# EAGLE design esp-oled-thing (EAGLE 6.2)
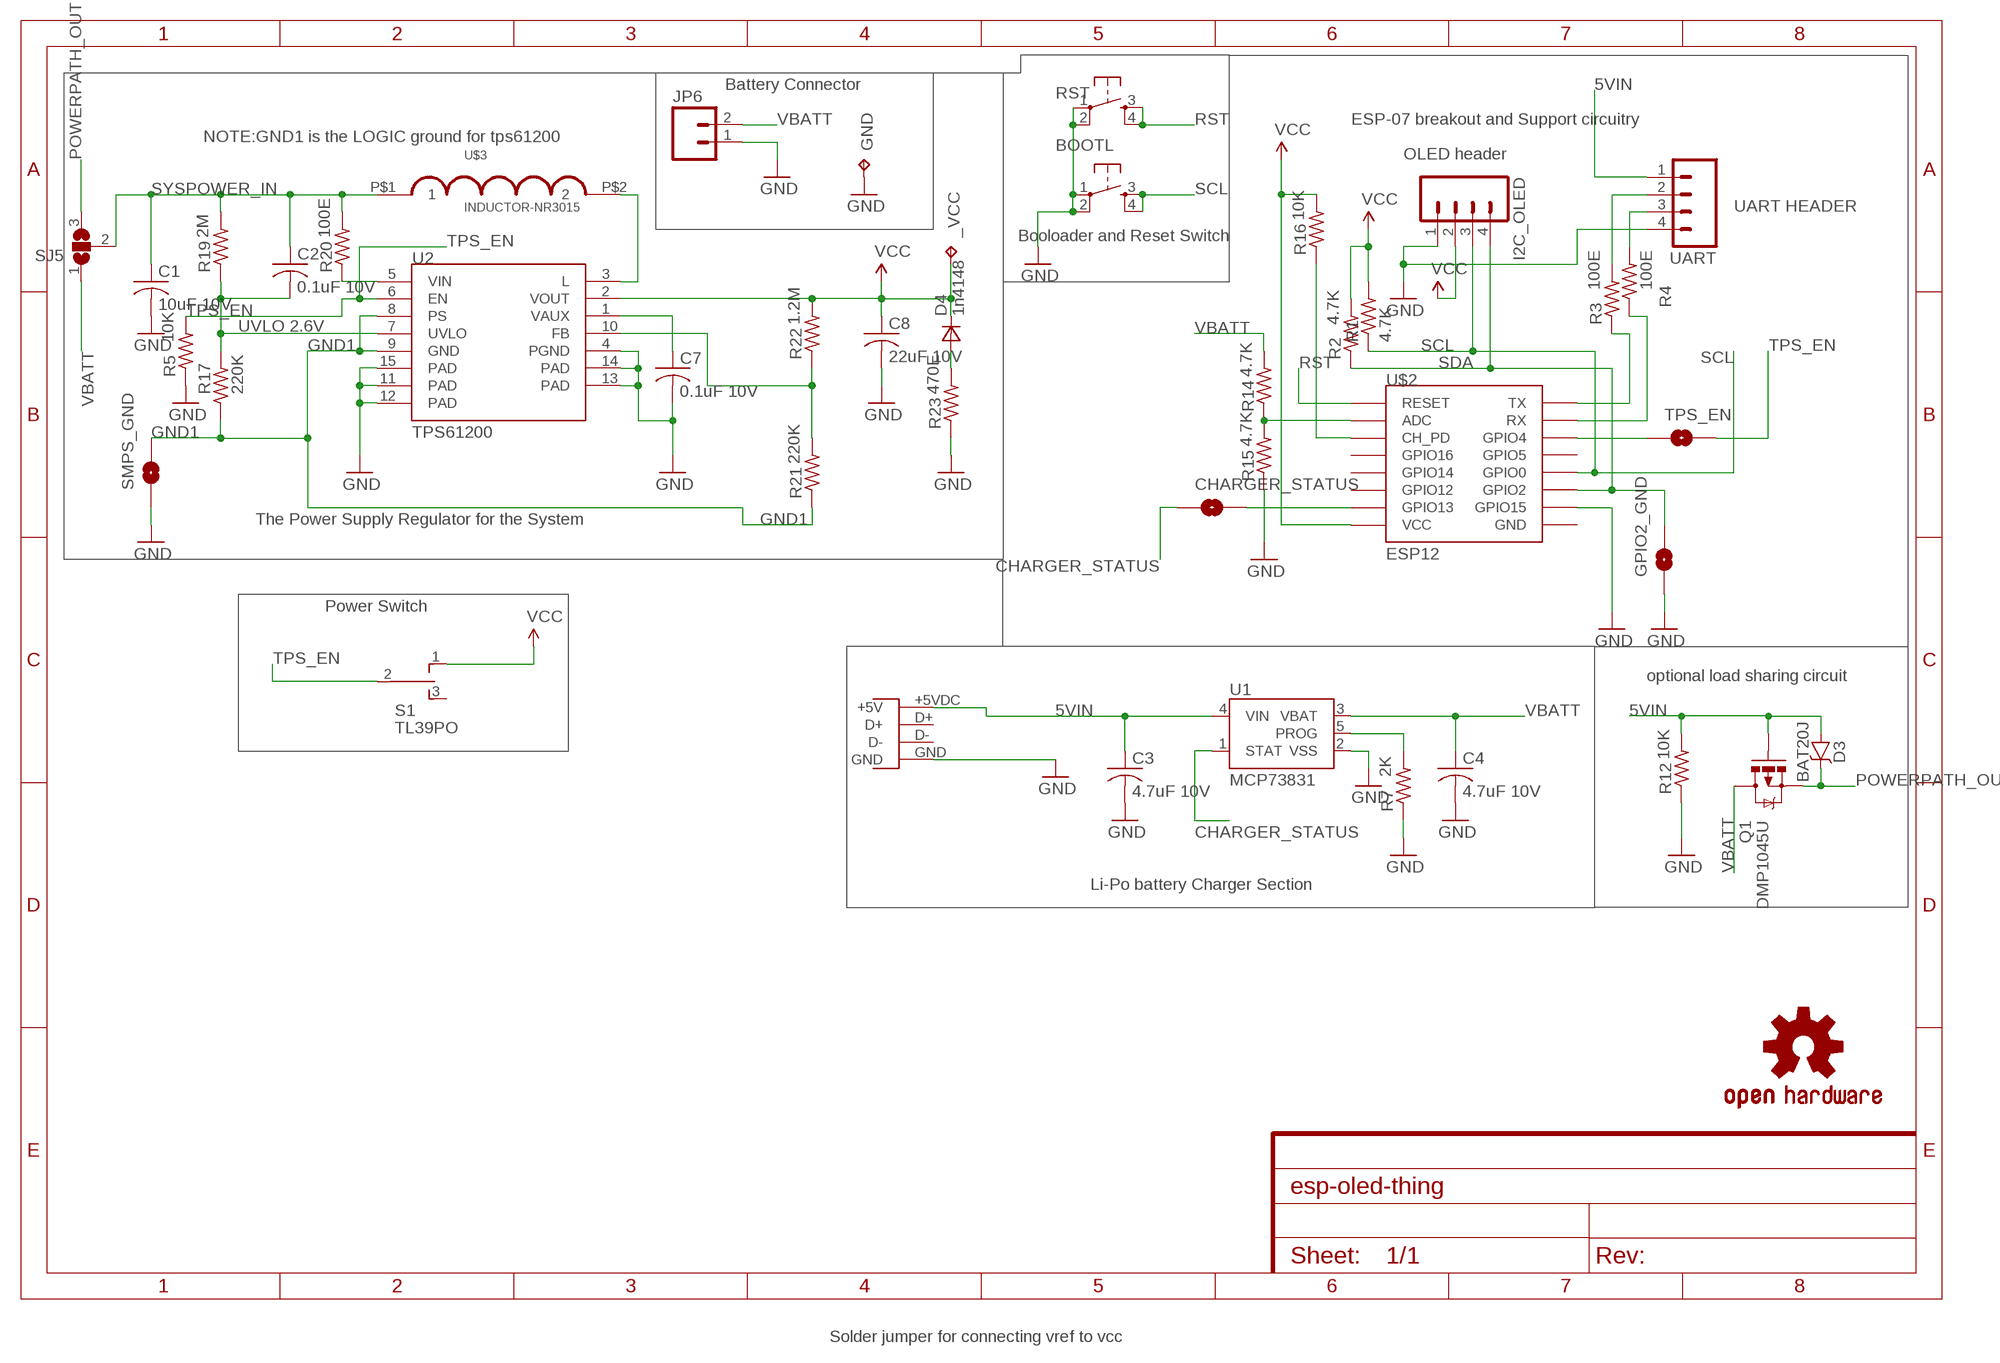
[diagram p0: schematic, sheet 1]

## Parts
_VCC  TPTP10R  [TP10R]
BOOTL  TAC_SWITCHSMD  [TACTILE_SWITCH_SMD]
C1  10uF 10V  C-USC0805  [C0805]
C2  0.1uF 10V  C-USC0805  [C0805]
C3  4.7uF 10V  C-USC0805  [C0805]
C4  4.7uF 10V  C-USC0805  [C0805]
C7  0.1uF 10V  C-USC0805  [C0805]
C8  22uF 10V  C-USC0805  [C0805]
CHARGER_STATUS  SOLDERJUMPERNO  [SJ_2S-NO]
D3  BAT20J  DIODE-SCHOTTKY-BAT20J  [SOD-323]
D4  1n4148  DSOD323  [SOD323]
GND  TPTP10R  [TP10R]
GPIO2_GND  SOLDERJUMPERNO  [SJ_2S-NO]
I2C_OLED  M04PTH  [1X04]
JP6  M02JST-PTH-2  [JST-2-PTH]
Q1  DMP1045U  MOSFET-PCHANNELDMG2307L  [SOT23-3]
R1  4.7K  R-US_M0805  [M0805]
R2  4.7K  R-US_M0805  [M0805]
R3  100E  R-US_M0805  [M0805]
R4  100E  R-US_M0805  [M0805]
R5  10K  R-US_M0805  [M0805]
R7  2K  R-US_M0805  [M0805]
R12  10K  R-US_M0805  [M0805]
R14  4.7K  R-US_M0805  [M0805]
R15  4.7K  R-US_M0805  [M0805]
R16  10K  R-US_M0805  [M0805]
R17  220K  R-US_M0805  [M0805]
R19  2M  R-US_M0805  [M0805]
R20  100E  R-US_M0805  [M0805]
R21  220K  R-US_M0805  [M0805]
R22  1.2M  R-US_M0805  [M0805]
R23  470E  R-US_M0805  [M0805]
RST  TAC_SWITCHSMD  [TACTILE_SWITCH_SMD]
S1  TL39PO  [TL3XPO]
SJ5  SJ2W  [SJ_2]
SMPS_GND  SOLDERJUMPERNO  [SJ_2S-NO]
TPS_EN  SOLDERJUMPERNO  [SJ_2S-NO]
U1  MCP73831  [SOT23-5]
U2  TPS61200  [QFN-10_PAD]
U$1  OSHW-LOGOS  [OSHW-LOGO-S]
U$2  ESP12  [ESP12]
U$3  INDUCTOR-NR3015  [INDUCTOR-NR3015]
U$4  MICROUSB-MIDMOUNT  [MICROUSB-MIDMOUNT-MOLEX]
UART  M04LONGPADS  [1X04_LONGPADS]

## Nets
5VIN: C3.1 D3.A Q1.1(G) R12.2 U1.4(VIN) U$4.+5VDC(+5V) UART.1
CHARGER_STATUS: CHARGER_STATUS.1 U1.1(STAT)
FB: R21.2 R22.1 U2.10(FB)
GND: BOOTL.1 BOOTL.2 C1.2 C3.2 C4.2 C7.2 C8.2 GND.TP GPIO2_GND.1 I2C_OLED.1 JP6.1 R5.1 R7.1 R12.1 R15.1 R23.1 RST.1 RST.2 SMPS_GND.1 U1.2(VSS) U2.4(PGND) U2.11(PAD) U2.12(PAD) U2.13(PAD) U2.14(PAD) U2.15(PAD) U$2.GPIO15 U$4.GND UART.4
GND1: R17.1 R21.1 SMPS_GND.2 U2.8(PS) U2.9(GND)
N$1: CHARGER_STATUS.2 U$2.GPIO13
N$2: R14.1 R15.2 U$2.ADC
N$3: R16.1 U$2.CH_PD
N$4: R3.2 UART.2
N$5: TPS_EN.1 U$2.GPIO4
N$8: R4.2 UART.3
N$13: R7.2 U1.5(PROG)
N$14: U2.3(L) U$3.P$2
N$18: C7.1 U2.1(VAUX)
N$19: R3.1 U$2.TX
N$20: R4.1 U$2.RX
N$21: D4.2(A) R23.2
POWERPATH_OUT: D3.C Q1.2(S) SJ5.3
RST: RST.3 RST.4 U$2.RESET
SCL: BOOTL.3 BOOTL.4 I2C_OLED.3 R1.1 U$2.GPIO0
SDA: GPIO2_GND.2 I2C_OLED.4 R2.1 U$2.GPIO2
SYSPOWER_IN: C1.1 C2.1 R19.2 R20.2 SJ5.2 U$3.P$1
TPS_EN: R5.2 S1.2(P) TPS_EN.2 U2.6(EN)
UVLO: C2.2 R17.2 R19.1 U2.7(UVLO)
VBATT: C4.1 JP6.2 Q1.3(D) R14.2 SJ5.1 U1.3(VBAT)
VCC: _VCC.TP C8.1 D4.1(C) I2C_OLED.2 R1.2 R2.2 R16.2 R22.2 S1.1(O) U2.2(VOUT) U$2.VCC
VIN: R20.1 U2.5(VIN)
Unconnected: S1.3(S) U$2.GND U$2.GPIO5 U$2.GPIO12 U$2.GPIO14 U$2.GPIO16 U$4.D+ U$4.D-

## Notes on the sheet
- Battery Connector
- ESP-07 breakout and Support circuitry
- NOTE:GND1 is the LOGIC ground for tps61200
- OLED header
- UART HEADER
- Booloader and Reset Switch
- UVLO 2.6V
- The Power Supply Regulator for the System
- Power Switch
- optional load sharing circuit
- Li-Po battery Charger Section
- Solder jumper for connecting vref to vcc

## Library data of the parts
_VCC GND = testpad:TP: Test pad
BOOTL RST = SparkFun:TAC_SWITCH: Momentary Switch Button commonly used for reset or general input. Spark Fun Electronics SKU : COM-00097
C1-C4 C7 C8 = rcl:C-US: CAPACITOR, American symbol
CHARGER_STATUS GPIO2_GND SMPS_GND TPS_EN = SparkFun:SOLDERJUMPER: Solder Jumper Standard SMD solder jumper. Used to automate production. Two varients : Normally Open and Normally Closed are the same, but have different paste layers. NC will have a large amount of paste and should jumper during reflow.
D3 = SparkFun-DiscreteSemi:DIODE-SCHOTTKY: Schottky diodes in SFE's production catalog BAT20J 1A 23V 0.62Vf RB751 120mA 40V 0.37Vf PMEG4005EJ 0.5A 40V 0.42Vf MBRA140 1A 40V 0.5Vf B340A 3A 40V SMA; PROD_ID: DIO-11623
D4 = zetex:D: DIODE; MPN: CDSOD323-T05C; OC_FARNELL: 1824860; OC_NEWARK: 79R6078
I2C_OLED UART = SparkFun:M04: Header 4 Standard 4-pin 0.1" header. Use with straight break away headers (SKU : PRT-00116), right angle break away headers (PRT-00553), swiss pins (PRT-00743), machine pins (PRT-00117), and female headers (PRT-00115). Molex polarized connector foot print use with SKU : PRT-08231 with associated crimp pins and housings. 1MM SMD Version SKU: PRT-10208
JP6 = SparkFun:M02: Header 2 Standard 2-pin 0.1" header. Use with straight break away headers (SKU : PRT-00116), right angle break away headers (PRT-00553), swiss pins (PRT-00743), machine pins (PRT-00117), and female headers (PRT-00115). Molex polarized connector foot print use with SKU : PRT-08233 with associated crimp pins and housings.
Q1 = SparkFun-DiscreteSemi:MOSFET-PCHANNEL: Generic PMOSFET IRLML2244 - TRANS-11153 (SOT-23 -20V -4.3A) (1.Gate 2.Source 3.Drain) FQP27P06 - COM-10349 <http://www.sparkfun.com/products/10349> (TO-220 -60V -27A) (1.Gate 2.Source 3.Drain); PROD_ID: TRANS-11308; VALUE: 2.5A/30V
R1-R5 R7 R12 R14-R17 R19-R23 = adafruit:R-US_: RESISTOR, American symbol
S1 = switch:TL39PO: TINY SWITCH ON OFF ON Source: http://www2.produktinfo.conrad.com/datenblaetter/700000-724999/705152-da-01-de-Subminiaturschalter_TL_36YO.pdf
SJ5 = jumper:SJ2W: SMD solder JUMPER
U1 = SparkFun:MCP73831: Microchip's MCP73831 Miniature single cell, fully integrated Li-Ion, Li-polymer charge management controller http://ww1.microchip.com/downloads/en/DeviceDoc/21984a.pdf
U2 = SparkFun:TPS61200: DC to DC Booster
U$1 = SparkFun:OSHW-LOGO: Open Source Hardware Logo This logo indicates the piece of hardware it is found on incorporates a OSHW license and/or adheres to the definition of open source hardware found here: http://freedomdefined.org/OSHW
U$2 = esp8266modules:ESP12: ESP8266 Wifi module 12
U$3 = farasbee:INDUCTOR-NR3015
U$4 = farasbee:MICROUSB-MIDMOUNT

## Board
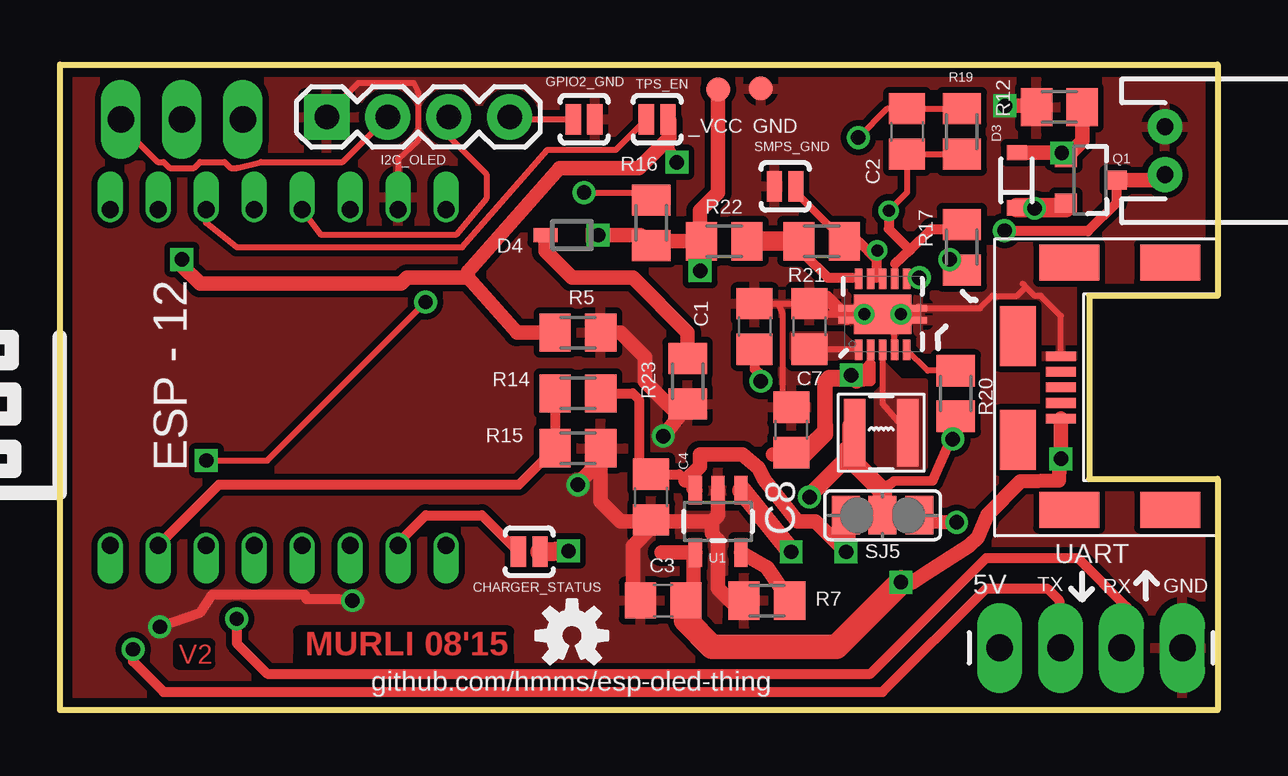
[diagram p1: board, top side]
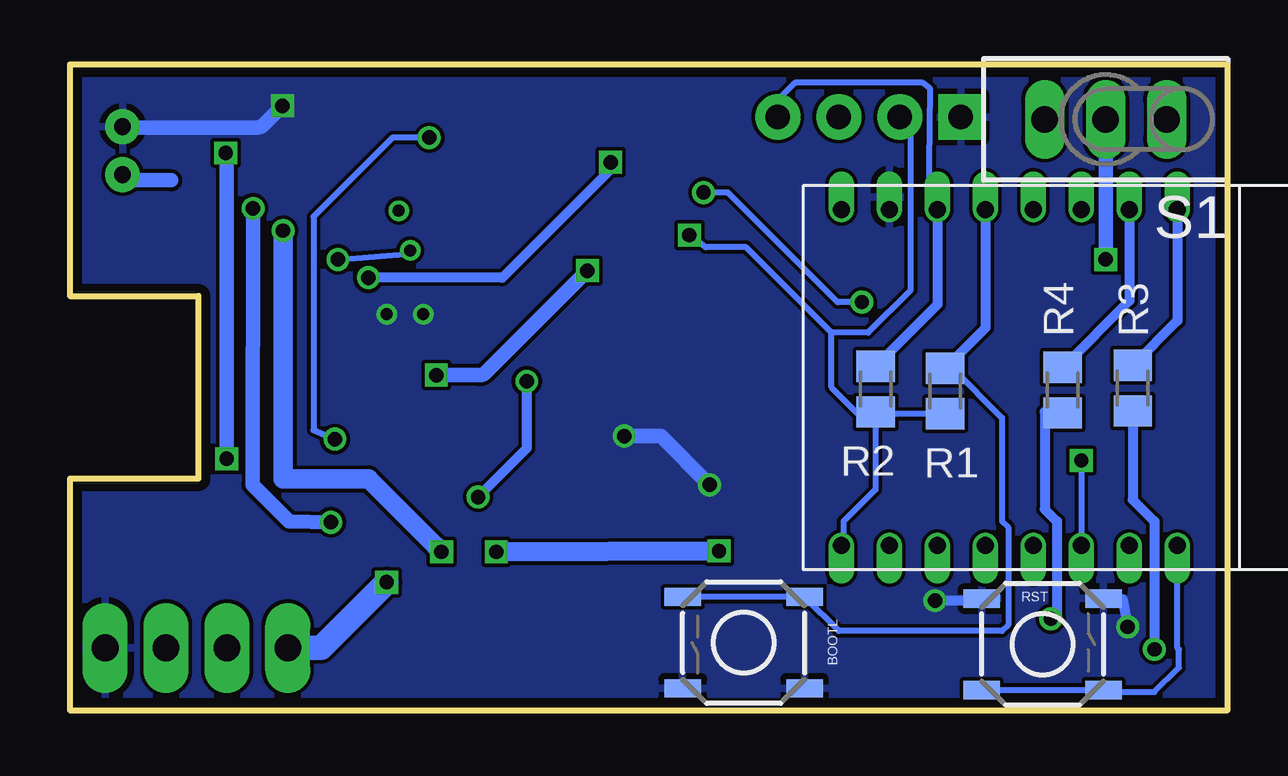
[diagram p2: board, bottom side, seen from below]

Size 48.26 x 27 mm. Coordinates in mm from the lower left corner, seen from the top.
Outline: 0,0 48.24,0
Outline: 48.24,27 0,27 0,26.92
Outline: 0,0 48.26,0 48.26,9.65 42.9,9.65 42.9,17.27 48.26,17.27 48.26,26.92 0,26.92
Outline: 0,0 0,26.92
Copper layers (1*16): Top 0.0356mm / dielectric 1.5011mm / Bottom 0.0356mm
Design rules: minimum track width 6mil, minimum drill 13mil, track to track 6mil, track to pad 6mil, pad to pad 6mil, via to via 6mil, smd to smd 6mil, copper to edge 15mil, drill to drill 6mil, minimum pad ring 7mil, minimum via ring 7mil, stop-mask expansion 3mil, vias tented up to drill 0mil, thermal gap 10mil

### Footprints (pad centres in the part's own frame; a part is rotated, then mirrored left to right if it is on the bottom)
TP10R = smd 1 x 1: TP 0,0
TACTILE_SWITCH_SMD = smd 1.524 x 0.762: 1 -2.54,1.905; 2 2.54,1.905; 3 -2.54,-1.905; 4 2.54,-1.905
C0805 = smd 1.3 x 1.5: 1 -0.95,0; 2 0.95,0
SJ_2S-NO = smd 0.635 x 1.27: 1 -0.45,0; 2 0.45,0
SOD-323 = smd 0.63 x 0.83: A 1.15,0; C -1.15,0
SOD323 = smd 1 x 0.6: 1 -1.1,0; 2 1.1,0
1X04 = drill 1.016 pad 1.88 square: 1 0,0 | drill 1.016 pad 1.88: 2 2.54,0; 3 5.08,0; 4 7.62,0
JST-2-PTH = drill 0.7 pad 1.448: 1 -1,0; 2 1,0
SOT23-3 = smd 0.8 x 0.9: 1 -0.95,-1; 2 0.95,-1; 3 0,1.1
M0805 = smd 1.3 x 1.6: 1 -0.95,0; 2 0.95,0
TL3XPO = drill 1.1 pad 1.422 long: 1 -2.54,0; 2 0,0; 3 2.54,0
SJ_2 = smd 1.168 x 1.6: 1 -1.524,0; 2 0,0; 3 1.524,0
SOT23-5 = smd 0.55 x 1.2: 1 -0.95,-1.3; 2 0,-1.3; 3 0.95,-1.3; 4 0.95,1.3; 5 -0.95,1.3
QFN-10_PAD = smd 0.297 x 0.85: 1 -1,-1.475; 2 -0.5,-1.475; 3 0,-1.475; 4 0.5,-1.475; 5 1,-1.475; 6 1,1.475; 7 0.5,1.475; 8 0,1.475; 9 -0.5,1.475; 10 -1,1.475 | smd 0.7 x 0.28: 11 -1.5,0.25; 12 -1.5,-0.25; 13 1.5,0.25; 14 1.5,-0.25 | smd 2.4 x 1.65: 15 0,0
ESP12 = drill 0.7 offset: ADC -7.1,3.8; CH_PD -7.1,1.8; GND 6.9,-8.2; GPIO0 6.9,-2.2; GPIO2 6.9,-4.2; GPIO4 6.9,1.8; GPIO5 6.9,-0.2; GPIO12 -7.1,-4.2; GPIO13 -7.1,-6.2; GPIO14 -7.1,-2.2; GPIO15 6.9,-6.2; GPIO16 -7.1,-0.2; RESET -7.1,5.8; RX 6.9,3.8; TX 6.9,5.8; VCC -7.1,-8.2
INDUCTOR-NR3015 = smd 0.9 x 2.8: P$1 -1.1,0; P$2 1.1,0
MICROUSB-MIDMOUNT-MOLEX = smd 0.4 x 1.25: +5VDC -1.3,0.95; D+ 0,0.95; D- -0.65,0.95; GND 1.3,0.95; ID 0.65,0.95 | smd 1.5 x 2.5: MT1 -5.1,-3.6; MT2 -5.1,0.6; MT5 5.2,0.6; MT6 5.2,-3.6 | smd 2.5 x 1.5: MT3 -2.2,2.75; MT4 2.15,2.75
1X04_LONGPADS = drill 1.118 pad 1.88 long: 1 0,0; 2 2.54,0; 3 5.08,0; 4 7.62,0

### Placement (x,y rotation side)
_VCC  27.43,25.89 0 top
BOOTL  20.17,2.82 180 bottom
C1  28.96,16 90 top
C2  35.31,24.13 270 top
C3  25.15,4.57 180 top
C4  24.64,8.89 270 top
C7  31.24,16 90 top
C8  30.48,11.68 90 top
CHARGER_STATUS  19.56,6.6 180 top
D3  39.88,22.1 90 top
D4  21.34,19.81 180 top
GND  29.21,25.92 0 top
GPIO2_GND  21.84,24.64 180 top
I2C_OLED  11.12,24.74 0 top
JP6  46.06,23.33 270 top
Q1  42.93,22.1 270 top
R1  11.77,13.31 270 bottom
R2  14.67,13.39 270 bottom
R3  3.95,13.43 270 bottom
R4  6.87,13.35 270 bottom
R5  21.59,15.75 180 top
R7  29.46,4.57 0 top
R12  41.66,25.15 0 top
R14  21.59,13.21 0 top
R15  21.59,10.92 180 top
R16  24.64,20.32 270 top
R17  37.59,19.3 90 top
R19  37.59,24.13 90 top
R20  37.34,13.21 270 top
R21  31.75,19.56 180 top
R22  27.69,19.56 180 top
R23  26.16,13.72 90 top
RST  7.71,2.75 0 bottom
S1  5.08,24.64 180 bottom
SJ5  34.29,8.13 0 top
SMPS_GND  30.23,21.84 0 top
TPS_EN  24.89,24.64 0 top
U1  27.43,7.87 180 top
U2  34.29,16.51 0 top
U$1  21.34,3.11 0 top
U$2  7.89,13.97 90 top
U$3  34.23,11.57 0 top
U$4  42.67,13.46 90 top
UART  39.17,2.6 0 top

### Tracks (layer width: path | path; a pad name or v marks a point on that pad's centre or on a via)
5VIN  (via drill 0.6)
  Top 0.254: 26.42,5.33 26.42,4.89 C3.1
  Top 0.305: 26.42,6.51 U1.4 | 41.73,23.25 Q1.1 41.91,23.03 v41.76,23.24 | 41.66,10.41 v41.72,10.48
  Top 0.61: 26.42,5.33 26.42,6.51 | Q1.1 42.61,23.73 R12.2 | 41.73,23.25 D3.A | 25.06,6.57 U1.4 | v35.05,5.33 35.54,5.33 36.09,5.71 37.89,6.84 38.25,7.21 38.65,8.15 40.03,9.55 41.63,9.58 41.66,10.12 41.66,10.41 | U$4.+5VDC v41.72,10.48
  Top 1.016: C3.1 26.1,3.74 27.19,2.65 32.37,2.65 v35.05,5.33
  Bottom 0.305: v41.76,23.24 41.72,22.67
  Bottom 0.61: 41.72,22.67 v41.72,10.48
  Bottom 1.016: UART.1 37.79,2.6 v35.05,5.33
CHARGER_STATUS  (via drill 0.6)
  Top 0.61: U1.1 28.42,9.17
  Top 0.813: 28.42,9.17 v30.48,6.6 | v21.2,6.64 CHARGER_STATUS.1
  Bottom 0.813: v30.48,6.6 v21.2,6.64
FB
  Top 0.254: 33.07,17.98 U2.10 33.24,18.03 33.02,18.03 | R21.2 30.8,19.24 30.99,19.05
  Top 0.406: 30.99,19.05 32,18.03 33.02,18.03
  Top 0.813: 28.45,19.56 R22.1 R21.2
GND  (via drill 0.5, 0.6)
  Top 0.254: U2.15 34.4,16.62 34.8,16.62 34.79,16.61 U2.4 | U2.11 U2.12 | U2.14 U2.13 38.35,16.76 38.86,17.27 39.88,17.27 40.26,17.65 | I2C_OLED.1 11.12,24.84 12.45,26.16 14.73,26.16 14.93,25.78 14.93,23.75 14.09,22.98 U$2.GPIO15 | C1.2 29.97,16.95 | 29.97,16.95 C7.2 | 30.23,12.89 C8.2 30.11,13 30.11,16.56 29.97,16.95 | U$4.GND 41.72,16.44 40.89,17.27 40.64,17.27 40.26,17.65 | 40.26,17.65 40.13,17.78
  Top 0.305: 32,16.51 v33.53,16.51
  Top 0.406: v33.53,16.51 32.77,16.51 32,17.27 32,17.05 U2.12 | v35.05,16.51 35.54,16.51 U2.13 | v4.16,3.48 5.84,4.06 6.35,4.83 10.21,4.83 10.27,4.63 11.62,4.63 v12.19,4.57
  Top 0.61: U1.2 27.43,8.13 27.18,7.87 | 27.18,7.87 24.7,7.87 C4.2 | R15.1 22.54,10.41 | 22.54,10.41 22.54,8.7 23.37,7.87 24.57,7.87 C4.2 | C4.2 24.64,7.62 23.88,6.86 23.88,4.89 C3.2 | R5.1 23.37,15.75 24.38,14.73 24.38,13.72 25.65,12.45 25.84,12.45 R23.1 26.16,12.7 v25.15,11.43 | v21.59,9.4 21.59,9.46 22.54,10.41 | 27.18,7.87 27.18,7.37 27.43,7.11 27.43,5.08 28.45,4.06 28.45,4.51 R7.1 | R12.1 arc45 40.58,25.2 v39.39,25.2
  Bottom 0.406: RST.2 4.38,4.63 v4.16,3.48 | v12.19,4.57 11.1,4.57 RST.1
  Bottom 0.61: v25.15,11.43 23.62,11.43 v21.59,9.4 | v39.39,25.2 40.2,24.39 arc45 40.42,24.3 46.05,24.3
  pour Bottom (rank 6): 0,0 48.26,0 48.26,9.65 42.67,9.65 42.67,17.27 48.26,17.27 48.26,26.92 0,26.92
  pour Top (isolate 0.254, rank 6): 42.67,17.27 42.67,9.65 48.26,9.65 48.26,9.4 48.26,0 0,0 0,26.92 48.26,26.92 48.26,17.27
GND1  (via drill 0.5, 0.6)
  Top 0.254: U2.8 U2.9 34.04,18.23 34.04,18.8 v34.07,19.17 | R21.1 33.27,19.56 | R17.1 37.02,18.35 v37.08,18.8
  Top 0.305: SMPS_GND.2 30.73,21.84 30.73,21.52 R21.1
  Top 0.406: 33.27,19.56 34.04,18.8 34.04,18.03
  Bottom 0.254: v37.08,18.8 34.04,19.05 v34.07,19.17
N$1
  Top 0.406: U$2.GPIO13 14.09,6.98 15.24,8.13 17.58,8.13 CHARGER_STATUS.2
N$2
  Top 0.406: U$2.ADC 6.62,9.4 19.12,9.4 R15.2 R14.1
N$3  (via drill 0.6)
  Top 0.254: v6.1,10.41 8.64,10.41 v15.24,17.02 | v21.84,21.59 24.32,21.59 R16.1
  Bottom 0.254: v6.1,10.41 U$2.CH_PD | v15.24,17.02 16.26,17.02 20.83,21.59 v21.84,21.59
N$4  (via drill 0.6)
  Top 0.406: UART.2 41.66,2.52 41.66,4.57 41.15,5.08 38.61,5.08 34.29,0.76 4.32,0.76 3.05,2.03 v3.05,2.54
  Bottom 0.406: R3.2 3.95,8.78 3.05,7.87 v3.05,2.54
N$5
  Top 0.254: U$2.GPIO4 6.09,20.33 7.37,19.3 16.76,19.3 20.32,23.37 23.17,23.37 TPS_EN.1
N$8  (via drill 0.6)
  Top 0.406: UART.3 44.45,2.3 44.45,4.32 42.42,6.35 38.61,6.35 33.78,1.52 8.64,1.52 7.37,2.79 v7.37,3.81
  Bottom 0.406: R4.2 7.57,12.4 7.62,12.45 7.62,8.38 7.11,7.87 7.11,4.06 v7.37,3.81
N$13
  Top 0.61: U1.5 29.46,5.97 R7.2
N$14
  Top 0.254: U2.3 34.29,12.78 U$3.P$2
  pour Top (no thermals): 34.29,14.48 34.29,13.46 34.04,13.21 34.04,10.16 36.07,10.16 36.07,13.72 35.05,13.72
N$18
  Top 0.254: C7.1 31.26,15.04 31.43,15.04 U2.1
  pour Top (no thermals): 30.53,15.68 30.53,15.69 32.31,15.69 32.59,15.69 33.03,15.25 33.2,15.25 33.28,15.17 33.28,14.74 33.22,14.68 30.54,14.68 30.53,14.67 30.53,15.67 30.54,15.67
N$19
  Bottom 0.406: U$2.TX 2.09,16.24 R3.1
N$20
  Bottom 0.406: U$2.RX 4.09,17.08 R4.1
N$21
  Top 0.254: 26.42,14.99 26.42,14.92 R23.2
  Top 0.61: D4.2 20.24,19.13 21.34,18.03 23.88,18.03 26.16,15.75 R23.2
POWERPATH_OUT  (via drill 0.6)
  Top 0.406: 41.93,20.95 Q1.2
  Top 0.61: D3.C 40.01,20.95 v40.62,20.93 | v37.38,7.84 36.07,7.87 SJ5.3
  Top 0.813: D3.C 41.93,20.95
  Bottom 0.61: v40.62,20.93 40.64,9.4 39.12,7.87 v37.38,7.84
RST
  Bottom 0.254: RST.3 RST.4 5.13,0.76 3.05,0.76 2.03,1.78 2.03,2.54 2.09,2.6 U$2.RESET
SCL
  Top 0.254: I2C_OLED.3 16.2,23.93 17.78,22.35 17.78,21.34 16.51,19.81 10.89,19.81 U$2.GPIO0
  Bottom 0.254: R1.1 11.47,14.26 9.4,12.19 9.4,7.87 9.14,7.62 9.14,3.56 9.4,3.3 16.21,3.3 BOOTL.3 BOOTL.4
  Bottom 0.406: U$2.GPIO0 10.09,15.94 R1.1
SDA
  Top 0.254: 21.29,24.74 GPIO2_GND.2 18.84,24.64 I2C_OLED.4
  Bottom 0.254: U$2.GPIO2 12.45,21.23 12.39,25.91 12.7,26.16 18.03,26.16 18.74,25.45 I2C_OLED.4
  Bottom 0.406: U$2.GPIO2 12.09,16.92 R2.1
SYSPOWER_IN  (via drill 0.6)
  Top 0.254: SJ5.2 34.29,8.64 | 33.02,11.85 U$3.P$1 | R19.2 C2.1 34.48,25.08 v33.27,23.88 | 36.38,9.58 v37.21,11.3 37.34,11.43 37.34,11.68 R20.2 | 34.54,9.4 34.29,9.14 | 33.02,10.92 33.02,10.41
  Top 0.406: 28.96,14.99 28.96,14.22 29.21,13.97 v29.21,13.72 | v31.24,8.89 31.24,9.14 33.02,10.92 | 34.54,9.4 34.76,9.56 36.38,9.58 37.08,11.18 37.34,11.68
  Top 0.61: C1.1 28.96,14.99 | 33.01,12.53 33.02,12.02 U$3.P$1 | 32.77,10.92 32.77,10.41 v31.24,8.89
  Top 0.813: 33.02,11.85 33.02,10.92 | 33.02,10.41 34.29,9.14 SJ5.2
  Bottom 0.254: v33.27,23.88 34.8,23.88 38.1,20.57 38.1,11.68 v37.21,11.3
  Bottom 0.406: v29.21,13.72 29.21,10.92 v31.24,8.89
TPS_EN  (via drill 0.6)
  Top 0.305: U2.6 35.77,17.98 v35.81,18.03
  Top 0.406: 25.4,23.88 25.4,23.37 v25.71,22.84
  Top 0.61: TPS_EN.2 25.4,24.58 25.4,23.88 24.13,22.61 20.83,22.61 17.02,18.29 17.02,18.03 | R5.2 19.05,15.75 17.02,18.03 | v5.08,18.8 5.08,18.54 5.84,17.78 14.22,17.78 14.48,18.03 17.02,18.03
  Bottom 0.406: v25.71,22.84 25.65,22.61 30.23,18.03 35.77,18.03 | 35.77,18.03 35.81,17.98 | 35.77,18.03 v35.81,18.03
  Bottom 0.61: S1.2 v5.08,18.8
UVLO  (via drill 0.5)
  Top 0.254: 34.8,18.03 U2.7 34.81,18 34.81,18.61 | v34.54,20.83 35.31,21.59 C2.2 R19.1 | 37.08,20.07 37.4,20.07 R17.2
  Top 0.406: 34.81,18.61 35.43,19.18 | 35.43,19.18 36.32,20.07 37.08,20.07 | v34.54,20.83 34.54,20.07 35.43,19.18
VBATT  (via drill 0.6)
  Top 0.406: U1.3 26.08,9.57 25.82,9.84 C4.1 24.13,10.35 24.13,12.95 23.88,13.21 R14.2 | Q1.3 44.03,21.15 42.84,19.97 39.4,19.97 v39.37,20
  Top 0.61: 26.42,9.24 U1.3 | 26.08,9.57 26.67,10.16 26.67,10.67 28.45,10.67 29.11,10.11 29.37,9.6 30.73,7.87 31.5,7.87 v32.77,6.6 | Q1.3 45.83,22.1 JP6.2
  Top 0.813: SJ5.1 v32.77,6.6
  Bottom 0.61: Q1.3 45.83,22.1 JP6.2
  Bottom 0.813: 33.02,6.86 v32.77,6.6 35.81,9.65 39.37,9.65 v39.37,20
VCC  (via drill 0.6)
  Top 0.254: S1.1 2.54,24.38 4.06,22.86 4.32,22.86 4.57,22.61 5.59,22.61 5.84,22.86 6.86,22.86 7.11,22.61 7.37,22.61 8.38,22.86 11.79,22.86 I2C_OLED.2 | U2.2 33.79,13.98 33.78,13.97 | 31.24,10.67 30.55,10.67 C8.1 | R22.2 26.74,18.98
  Top 0.406: R16.2 24.64,19.05 | 33.78,13.97 v32.98,13.97 32,13.97 31.75,13.72 31.75,11.68 | 31.75,11.68 31.75,11.18 31.24,10.67 31.24,11.18 31.75,11.68 | 31.75,11.68 32,11.94 | 32,11.94 32,13.72 33.2,13.72 33.53,13.72 | 33.53,13.72 33.57,14.21 33.78,14.46 33.78,13.72 33.53,13.72 | 32,11.94 32,11.43 30.99,10.41 | 26.67,18.8 26.92,18.8
  Top 0.61: D4.1 24.2,19.81 R16.2 24.83,19.56 R22.2 | _VCC.TP 27.43,21.59 26.67,20.83 26.67,19.62 R22.2 | 29.72,10.67 30.41,10.67 C8.1 | 26.67,18.8 26.67,19.49 R22.2 | 26.74,18.98 arc45 26.68,18.86 v26.68,18.33 | v32.98,13.97 33.17,13.78 arc-45 33.2,13.72
  Bottom 0.254: R1.2 14.56,12.36 | 14.56,12.36 14.99,11.94 16.51,13.46 16.51,15.75 | I2C_OLED.2 13.21,24.28 13.21,17.53 14.99,15.75 16.51,15.75 | 16.51,15.75 20.07,19.3 21.76,19.3 D4.1 | U$2.VCC 16,6.96 16,7.87 14.67,9.21 R2.2 14.59,12.36 14.56,12.36
  Bottom 0.61: v26.68,18.33 30.95,14.06 arc45 31.17,13.97 v32.98,13.97
  other vias: 22.44,19.81
VIN
  Top 0.254: U2.5 36.17,14.16 R20.1

### Text on the board
Top: MURLI 08'15 | V2
tSilk: github.com/hmms/esp-oled-thing
_tsilk: 5V | TX | RX | GND